# EAGLE schematic 433brd (EAGLE 7.5.0)
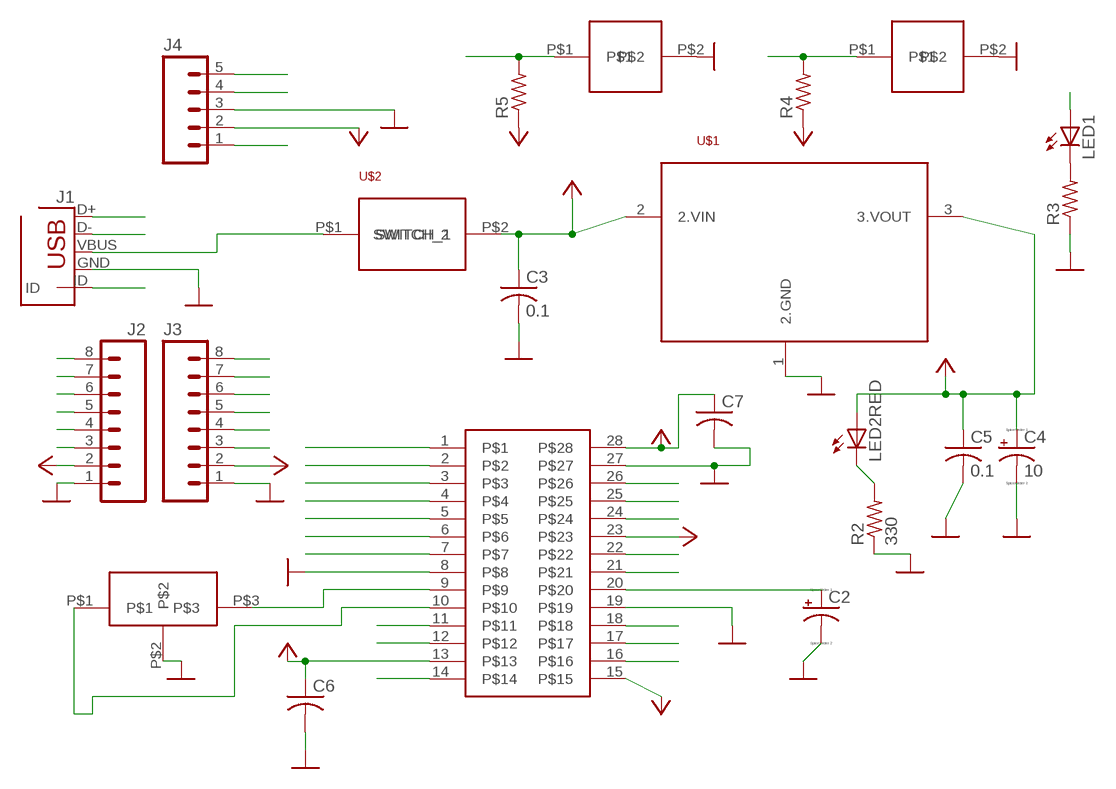
[diagram p0: schematic, sheet 1]

## Parts
C2  CPOL-USE1.8-4  [E1,8-4]
C3  0.1  C-US025-024X044  [C025-024X044]
C4  10  CPOL-USE1.8-4  [E1,8-4]
C5  0.1  C-US025-024X044  [C025-024X044]
C6  C-US025-024X044  [C025-024X044]
C7  C-US025-024X044  [C025-024X044]
J1  USB-MB-H  [USB-MB-H]
J2  M08  [1X08_ROUND]
J3  M08  [1X08_ROUND]
J4  M05PTH  [1X05]
LED1  LED3MM  [LED3MM]
LED2RED  LED3MM  [LED3MM]
R2  330  R-US_0204/7  [0204/7]
R3  R-US_0204/7  [0204/7]
R4  R-US_0204/7  [0204/7]
R5  R-US_0204/7  [0204/7]
U$1  MCP1702  [TO92]
U$2  SLIDE_SWITCH  [SLIDE_SWITCH]
U$3  RESONATOR  [RESONATOR]
U$4  DIPMOUNT  [DIL28-3]
U$5  PUSHBUTTON  [PUSHBUTTON]
U$6  PUSHBUTTON  [PUSHBUTTON]

## Nets
+3V3: C4.+ C5.1 C6.1 C7.1 J2.2 J4.2 LED2RED.A R4.1 R5.1 U$1.3(3.VOUT) U$4.13 U$4.23 U$4.28
+5V: C3.1 J3.2 U$1.2(2.VIN) U$2.P$2(SWITCH_2) U$4.15
A0: J2.8 U$4.2
A1: J2.7 U$4.3
A4/LED: J2.3 LED1.A U$4.12
B2: J2.6 U$4.6
B3: J2.5 U$4.7
B4/USER: J2.4 R5.2 U$4.11 U$5.P$1
B7: J3.3 U$4.16
B8: J3.4 U$4.17
B9: J3.5 U$4.18
B13: J3.6 U$4.24
B14: J3.7 U$4.25
B15: J3.8 U$4.26
D+: J1.D+ U$4.21
D-: J1.D- U$4.22
GND: C2.- C3.2 C4.- C5.2 C6.2 C7.2 J1.GND J2.1 J3.1 J4.3 R2.1 R3.1 U$1.1(2.GND) U$3.P$2 U$4.8 U$4.19 U$4.27 U$5.P$2 U$6.P$2
MCLR: J4.1 R4.2 U$4.1 U$6.P$1
N$1: U$3.P$3 U$4.9
N$2: LED2RED.K(C) R2.2
N$3: U$3.P$1 U$4.10
N$4: LED1.K(C) R3.2
N$12: C2.+ U$4.20
PGC: J4.5 U$4.5
PGD: J4.4 U$4.4
USBID: J1.ID U$4.14
VBUS: J1.VBUS U$2.P$1(SWITCH_1)

## Library data of the parts
C2 C4 = 433board:CPOL-US: POLARIZED CAPACITOR, American symbol
C3 C5-C7 = 433board:C-US: CAPACITOR, American symbol
J1 = 433board:USB: USB Connectors USB-B-PTH is fully proven SKU : PRT-00139/CONN-08278 USB-miniB is fully proven SKU : PRT-00587 USB-A-PCB is untested. USB-A-H is throughly reviewed, but untested. Spark Fun Electronics SKU : PRT-00437 USB-B-SMT is throughly reviewed, but untested. Needs silkscreen touching up. USB-A-S has not been used/tested USB-MB-H has not been used/tested USB-MICROB has been used. CONN-09505
J2 J3 = 433board:M08: Header 8 Standard 8-pin 0.1" header. Use with straight break away headers (SKU : PRT-00116), right angle break away headers (PRT-00553), swiss pins (PRT-00743), machine pins (PRT-00117), and female headers (PRT-00115).; PROD_ID: CONN-08437
J4 = 433board:M05: Header 5 Standard 5-pin 0.1" header. Use with straight break away headers (SKU : PRT-00116), right angle break away headers (PRT-00553), swiss pins (PRT-00743), machine pins (PRT-00117), and female headers (PRT-00115). Molex polarized connector foot print use with SKU : PRT-08230 with associated crimp pins and housings.
LED1 LED2RED = 433board:LED: LED OSRAM: - CHIPLED LG R971, LG N971, LY N971, LG Q971, LY Q971, LO R971, LY R971 LH N974, LH R974 LS Q976, LO Q976, LY Q976 LO Q996 - Hyper CHIPLED LW Q18S LB Q993, LB Q99A, LB R99A - SideLED LS A670, LO A670, LY A670, LG A670, LP A670 LB A673, LV A673, LT A673, LW A673 LH A674 LY A675 LS A676, LA A676, LO A676, LY A676, LW A676 LS A679, LY A679, LG A679 - Hyper Micro SIDELED® LS Y876, LA Y876, LO Y876, LY Y876 LT Y87S - SmartLED LW L88C, LW L88S LB L89C, LB L89S, LG L890 LS L89K, LO L89K, LY L89K LS L896, LA L896, LO L896, LY L896 - TOPLED LS T670, LO T670, LY T670, LG T670, LP T670 LSG T670, LSP T670, LSY T670, LOP T670, LYG T670 LG T671, LOG T671, LSG T671 LB T673, LV T673, LT T673, LW T673 LH T674 LS T676, LA T676, LO T676, LY T676, LB T676, LH T676, LSB T676, LW T676 LB T67C, LV T67C, LT T67C, LS T67K, LO T67K, LY T67K, LW E67C LS E67B, LA E67B, LO E67B, LY E67B, LB E67C, LV E67C, LT E67C LW T67C LS T679, LY T679, LG T679 LS T770, LO T770, LY T770, LG T770, LP T770 LB T773, LV T773, LT T773, LW T773 LH T774 LS E675, LA E675, LY E675, LS T675 LS T776, LA T776, LO T776, LY T776, LB T776 LHGB T686 LT T68C, LB T68C - Hyper Mini TOPLED® LB M676 - Mini TOPLED Santana® LG M470 LS M47K, LO M47K, LY M47K Source: http://www.osram.convergy.de LUXEON: - LUMILED® LXK2-PW12-R00, LXK2-PW12-S00, LXK2-PW14-U00, LXK2-PW14-V00 LXK2-PM12-R00, LXK2-PM12-S00, LXK2-PM14-U00 LXK2-PE12-Q00, LXK2-PE12-R00, LXK2-PE12-S00, LXK2-PE14-T00, LXK2-PE14-U00 LXK2-PB12-K00, LXK2-PB12-L00, LXK2-PB12-M00, LXK2-PB14-N00, LXK2-PB14-P00, LXK2-PB14-Q00 LXK2-PR12-L00, LXK2-PR12-M00, LXK2-PR14-Q00, LXK2-PR14-R00 LXK2-PD12-Q00, LXK2-PD12-R00, LXK2-PD12-S00 LXK2-PH12-R00, LXK2-PH12-S00 LXK2-PL12-P00, LXK2-PL12-Q00, LXK2-PL12-R00 Source: www.luxeon.com KINGBRIGHT: KA-3528ASYC Source: www.kingbright.com
R2-R5 = 433board:R-US_: RESISTOR, American symbol
U$1 = 433board:MCP1702
U$2 = 433board:SLIDE_SWITCH
U$3 = 433board:RESONATOR
U$4 = 433board:DIPMOUNT
U$5 U$6 = 433board:PUSHBUTTON